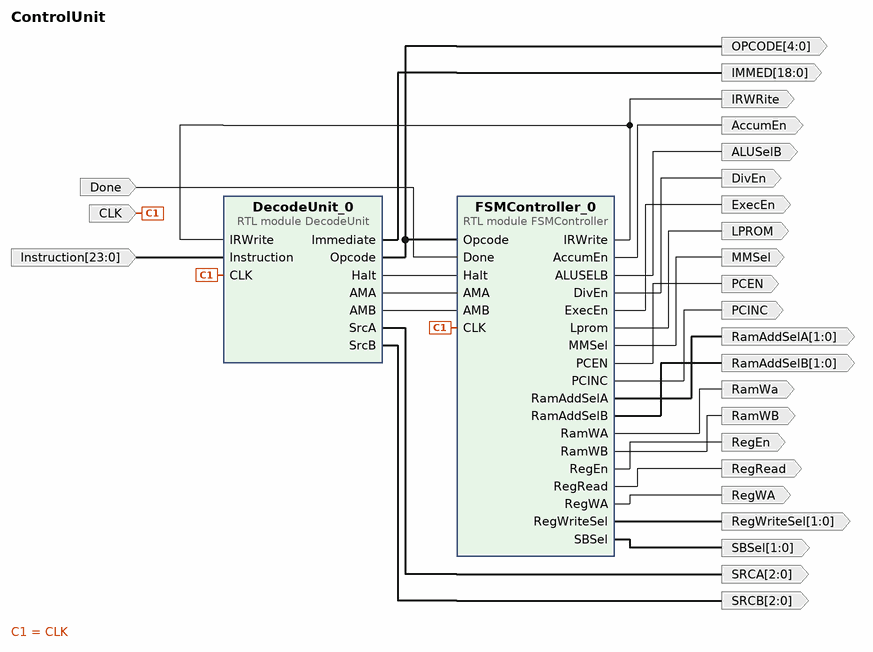
[diagram p0: block diagram of the top level]
# Vivado block design ControlUnit, xc7a100tcsg324-1, Vivado 2017.4
create_bd_design ControlUnit

create_bd_port -dir O -type data IRWRite
create_bd_port -dir O -from 2 -to 0 SRCA
create_bd_port -dir O -from 2 -to 0 -type data SRCB
create_bd_port -dir O -from 18 -to 0 -type data IMMED
create_bd_port -dir O -from 4 -to 0 -type data OPCODE
create_bd_port -dir I -type clk CLK
set_property -dict {CONFIG.FREQ_HZ 100000000} [get_bd_ports CLK]
create_bd_port -dir O RamWa
create_bd_port -dir O -type data LPROM
create_bd_port -dir O RamWB
create_bd_port -dir O -type data PCEN
create_bd_port -dir O -type data ALUSelB
create_bd_port -dir O -from 1 -to 0 -type data RegWriteSel
create_bd_port -dir O ExecEn
create_bd_port -dir O PCINC
create_bd_port -dir O -from 1 -to 0 RamAddSelA
create_bd_port -dir O -from 1 -to 0 RamAddSelB
create_bd_port -dir O -from 1 -to 0 SBSel
create_bd_port -dir O -type data DivEn
create_bd_port -dir O -type data RegWA
create_bd_port -dir O -type data AccumEn
create_bd_port -dir O RegEn
create_bd_port -dir O MMSel
create_bd_port -dir O RegRead
create_bd_port -dir I Done
create_bd_port -dir I -from 23 -to 0 -type data Instruction

create_bd_cell -type module -reference DecodeUnit DecodeUnit_0
create_bd_cell -type module -reference FSMController FSMController_0

# ---- connections ----

connect_bd_net [get_bd_pins DecodeUnit_0/Halt] [get_bd_pins FSMController_0/Halt]
connect_bd_net [get_bd_pins DecodeUnit_0/AMA] [get_bd_pins FSMController_0/AMA]
connect_bd_net [get_bd_pins DecodeUnit_0/AMB] [get_bd_pins FSMController_0/AMB]
connect_bd_net [get_bd_pins FSMController_0/IRWrite] [get_bd_ports IRWRite] [get_bd_pins DecodeUnit_0/IRWrite]
connect_bd_net [get_bd_pins DecodeUnit_0/SrcA] [get_bd_ports SRCA]
connect_bd_net [get_bd_pins DecodeUnit_0/SrcB] [get_bd_ports SRCB]
connect_bd_net [get_bd_pins DecodeUnit_0/Immediate] [get_bd_ports IMMED]
connect_bd_net [get_bd_pins DecodeUnit_0/Opcode] [get_bd_ports OPCODE] [get_bd_pins FSMController_0/Opcode]
connect_bd_net [get_bd_ports CLK] [get_bd_pins DecodeUnit_0/CLK] [get_bd_pins FSMController_0/CLK]
connect_bd_net [get_bd_pins FSMController_0/RamWA] [get_bd_ports RamWa]
connect_bd_net [get_bd_pins FSMController_0/Lprom] [get_bd_ports LPROM]
connect_bd_net [get_bd_pins FSMController_0/RamWB] [get_bd_ports RamWB]
connect_bd_net [get_bd_pins FSMController_0/PCEN] [get_bd_ports PCEN]
connect_bd_net [get_bd_pins FSMController_0/ALUSELB] [get_bd_ports ALUSelB]
connect_bd_net [get_bd_pins FSMController_0/RegWriteSel] [get_bd_ports RegWriteSel]
connect_bd_net [get_bd_pins FSMController_0/ExecEn] [get_bd_ports ExecEn]
connect_bd_net [get_bd_pins FSMController_0/PCINC] [get_bd_ports PCINC]
connect_bd_net [get_bd_pins FSMController_0/RamAddSelA] [get_bd_ports RamAddSelA]
connect_bd_net [get_bd_pins FSMController_0/RamAddSelB] [get_bd_ports RamAddSelB]
connect_bd_net [get_bd_pins FSMController_0/SBSel] [get_bd_ports SBSel]
connect_bd_net [get_bd_pins FSMController_0/DivEn] [get_bd_ports DivEn]
connect_bd_net [get_bd_pins FSMController_0/RegWA] [get_bd_ports RegWA]
connect_bd_net [get_bd_pins FSMController_0/AccumEn] [get_bd_ports AccumEn]
connect_bd_net [get_bd_pins FSMController_0/RegEn] [get_bd_ports RegEn]
connect_bd_net [get_bd_pins FSMController_0/MMSel] [get_bd_ports MMSel]
connect_bd_net [get_bd_pins FSMController_0/RegRead] [get_bd_ports RegRead]
connect_bd_net [get_bd_ports Done] [get_bd_pins FSMController_0/Done]
connect_bd_net [get_bd_ports Instruction] [get_bd_pins DecodeUnit_0/Instruction]

validate_bd_design
save_bd_design
